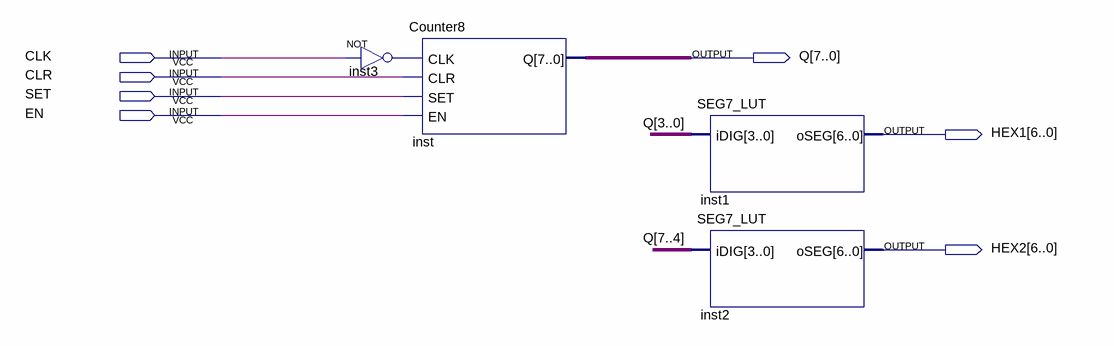
[diagram p0: schematic sheet]
// Quartus schematic Question5.bdf as structural Verilog: 4 symbols, 7 pins
module Question5 (
  input  CLK,
  input  CLR,
  input  SET,
  input  EN,
  output [7:0] Q,
  output [6:0] HEX1,
  output [6:0] HEX2
);

  wire inst3_out;

  not inst3 (inst3_out, CLK);
  Counter8 inst (.CLK(inst3_out), .CLR(CLR), .SET(SET), .EN(EN), .Q(Q));
  SEG7_LUT inst1 (.iDIG(Q[3:0]), .oSEG(HEX1));
  SEG7_LUT inst2 (.iDIG(Q[7:4]), .oSEG(HEX2));
endmodule
